# EasyEDA Pro project ProPrj_桌面数控电源New_2025-02-12.epro, board PCB3
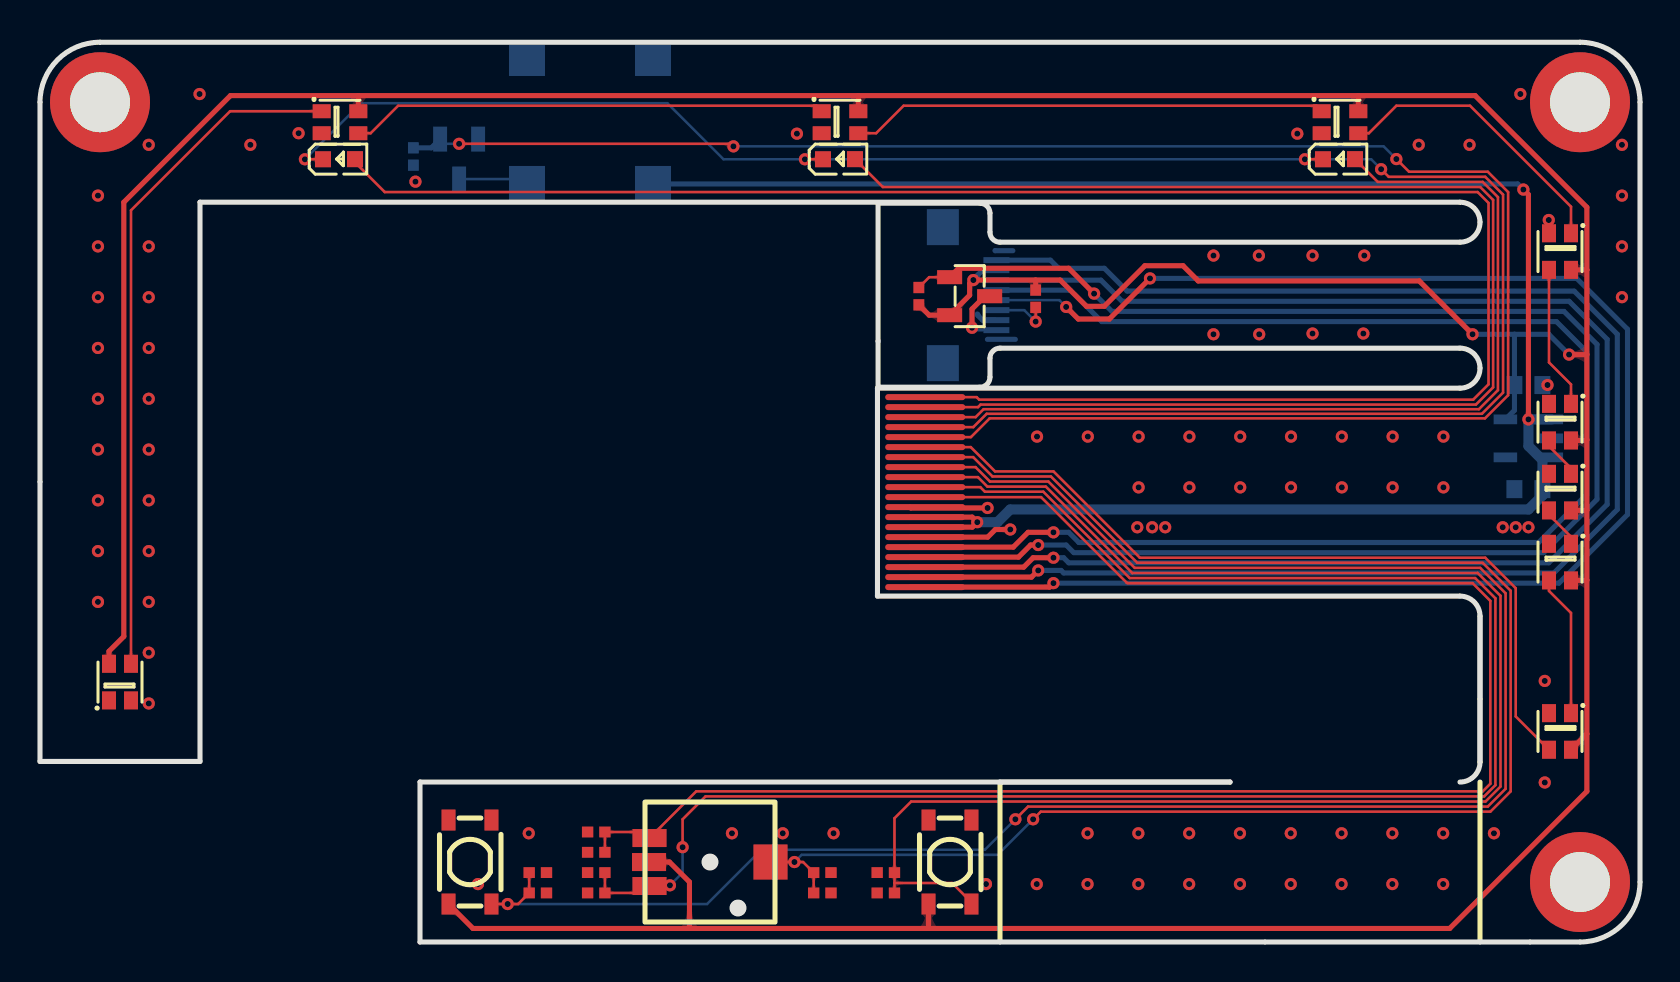
[diagram p4: board, top side]
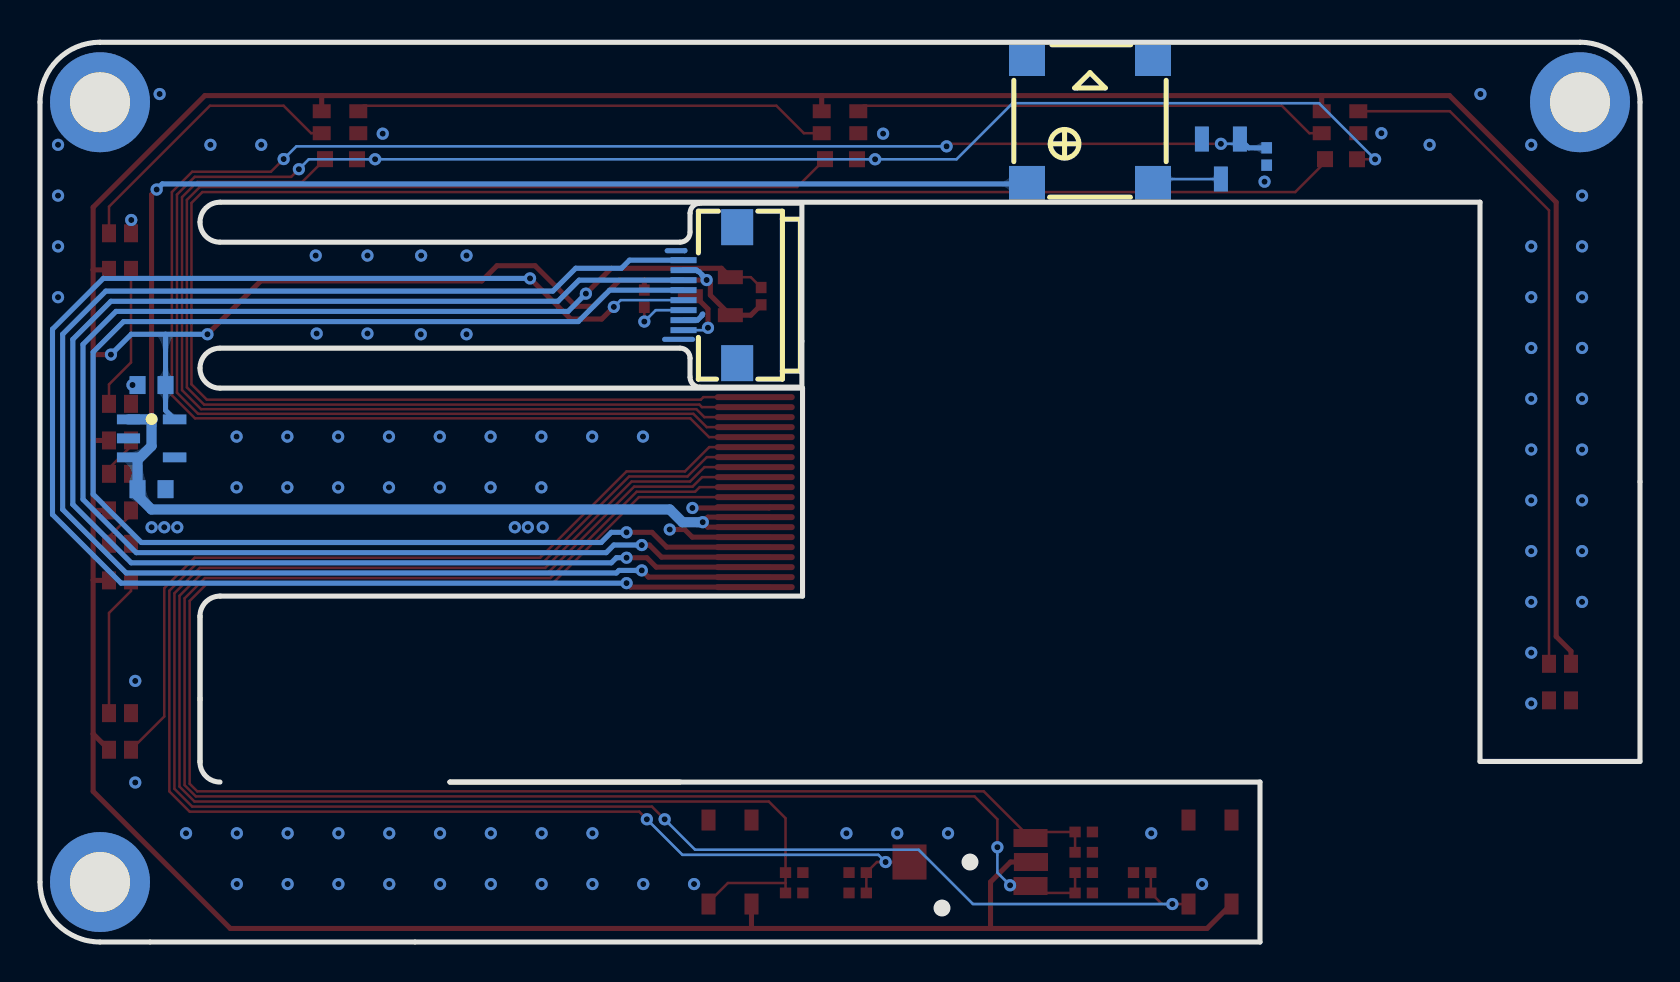
[diagram p5: board, bottom side, seen from below]

Outline 80 x 45 mm; copper layers: Top Layer, Bottom Layer. Coordinates in mm from the lower left corner of the outline.
Outline path: 48,8 59.5,8 19,8 19,0 77,0 arc(79.12,0.88) 80,3 80,42 arc(79.12,44.12) 77,45 3,45 arc(0.88,44.12) 0,42 0,9.03 8,9.03 8,37 71,37 arc(71.71,36.71) 72,36 arc(71.71,35.29) 71,35 48,35 arc(47.64,35.15) 47.5,35.5 47.5,36.45 arc(47.35,36.8) 47,36.95 41.9,36.95 41.9,27.75 47,27.75 arc(47.35,27.9) 47.5,28.25 47.5,29.2 arc(47.64,29.55) 48,29.7 71,29.7 arc(71.71,29.41) 72,28.7 arc(71.71,27.99) 71,27.7 41.87,27.7 41.87,17.3 71,17.3 arc(71.71,17.01) 72,16.3 ; 72,16.3 72,9 ; 72,16.3 72,9 ; 72,9 arc(71.71,8.29) 71,8
Stack: Top Layer 0.012mm / Dielectric1 0.025mm FR4 er 4.5 / Bottom Layer 0.012mm

## Design rules (mm)
template: JLCPCB Capability(Two Layers Board)
spacing copperThickness1oz (default): track to track 0.102, other pairs 0.152 to 0.3
spacing copperThickness2oz: track to track 0.203, other pairs 0.152 to 0.3
track width copperThickness1oz (default): min 0.127, default 0.254, max 2.54
track width copperThickness2oz: min 0.203, default 0.254, max 2.54
differential pair differentialPair (default): width min 0.127, default 0.254, max 2.54; gap min 0.152, default 0.152
via viaSize (default): diameter min 0.5, default 0.61, max 10; hole min 0.3, default 0.305, max 6.3

## Placement (name value [footprint] x y rotation side)
C28  22uF  [C0603]  74.42 22.65 0 bottom
C29  22uF  [C0603]  74.42 27.86 180 bottom
C96  100nF  [C0402]  42.29 3.47 180 top
C97  100nF  [C0402]  24.89 2.45 0 top
C98  100nF  [C0402]  39.12 2.45 0 top
C99  100nF  [C0402]  27.81 4.49 180 top
C100  100nF  [C0402]  27.81 3.47 180 top
FPC1  AFC01-S08FCA-00  [FPC-SMD_P0.50-8P_FGS-XJ-H2.0]  46.48 32.35 270 bottom
LDO1  ME6211C33M5G-N  [SOT-23-5_L3.0-W1.7-P0.95-LS2.8-BL]  74.42 25.19 270 bottom
LED1  WS2812B-2020  [LED-SMD_4P-L2.0-W2.0-TL_WS2812B-2020]  76 10.53 270 top
LED2  WS2812B-2020  [LED-SMD_4P-L2.0-W2.0-TL_WS2812B-2020]  76 19 270 top
LED3  WS2812B-2020  [LED-SMD_4P-L2.0-W2.0-TL_WS2812B-2020]  76 22.5 270 top
LED4  WS2812B-2020  [LED-SMD_4P-L2.0-W2.0-TL_WS2812B-2020]  76 26 270 top
LED5  WS2812B-2020  [LED-SMD_4P-L2.0-W2.0-TL_WS2812B-2020]  76 34.53 270 top
LED6  WS2812B-2020  [LED-SMD_4P-L2.0-W2.0-TL_WS2812B-2020]  65 41 0 top
LED7  WS2812B-2020  [LED-SMD_4P-L2.0-W2.0-TL_WS2812B-2020]  40 41 0 top
LED8  WS2812B-2020  [LED-SMD_4P-L2.0-W2.0-TL_WS2812B-2020]  15 41 0 top
LED9  -  [LED_0603]  15 39.16 0 top
LED10  -  [LED_0603]  40 39.16 0 top
LED11  -  [LED_0603]  65 39.16 0 top
LED12  WS2812B-2020  [LED-SMD_4P-L2.0-W2.0-TL_WS2812B-2020]  4 13 90 top
NOREF  -  [Pad_e144]  44.26 20.25 0 top
NOREF#2  -  [Pad_e128]  44.26 24.25 0 top
NOREF#3  -  [Pad_e132]  44.26 23.25 0 top
NOREF#4  -  [Pad_e15]  77 3 0 top
NOREF#5  -  [Pad_e142]  44.26 20.75 0 top
NOREF#6  -  [Pad_e152]  44.26 18.25 0 top
NOREF#7  -  [Pad_e134]  44.26 22.75 0 top
NOREF#8  -  [Pad_e126]  44.26 24.75 0 top
NOREF#9  -  [Pad_e154]  44.26 17.75 0 top
NOREF#10  -  [Pad_e140]  44.26 21.25 0 top
NOREF#11  -  [Pad_e116]  44.26 27.25 0 top
NOREF#12  -  [Pad_e136]  44.26 22.25 0 top
NOREF#13  -  [Pad_e13]  77 42 0 top
NOREF#14  -  [Pad_e150]  44.26 18.75 0 top
NOREF#15  -  [Pad_e148]  44.26 19.25 0 top
NOREF#16  -  [Pad_e138]  44.26 21.75 0 top
NOREF#17  -  [Pad_e124]  44.26 25.25 0 top
NOREF#18  -  [Pad_e130]  44.26 23.75 0 top
NOREF#19  -  [Pad_e120]  44.26 26.25 0 top
NOREF#20  -  [Pad_e12]  3 42 0 top
NOREF#21  -  [Pad_e118]  44.26 26.75 0 top
NOREF#22  -  [Pad_e122]  44.26 25.75 0 top
NOREF#23  -  [Pad_e146]  44.26 19.75 0 top
Q15  SI2302  [SOT-23-3_L2.9-W1.3-P1.90-LS2.4-BR]  20.96 39.16 90 bottom
Q16  SI2305  [SOT-23-3_L2.9-W1.3-P1.90-LS2.4-BR]  46.48 32.3 180 top
R75  10K  [R0402]  49.78 32.17 270 top
R81  10K  [R0402]  18.67 39.28 90 bottom
R82  10K  [R0402]  43.94 32.3 90 top
R83  1M  [R0402]  42.29 2.45 180 top
R84  1M  [R0402]  24.89 3.47 0 top
R85  1M  [R0402]  39.12 3.47 0 top
R86  1M  [R0402]  27.81 5.5 180 top
R87  1M  [R0402]  27.81 2.45 180 top
SW1  -  [EC06]  33.5 4 90 top
SW4  -  [Key_SMD_4.2x3.2x2.5]  45.5 4 90 top
SW5  -  [Key_SMD_4.2x3.2x2.5]  21.5 4 90 top
U1  2.731kHz  [BUZ-SMD_4P-L7.5-W7.5-BR]  27.5 41.06 270 bottom

## Footprints (pads in the part's own frame, mm; a bottom-side part is the same pattern mirrored in y, then rotated)
BUZ-SMD_4P-L7.5-W7.5-BR
  rect 1.8x1.8 smd: 1(3.15,-3.15) 2(3.15,3.15) 3(-3.15,3.15) 4(-3.15,-3.15)
C0402
  rect 0.566x0.54 smd: 1(-0.433,0) 2(0.433,0)
C0603
  rect 0.8x0.9 smd: 1(-0.7,0) 2(0.7,0)
EC06
  rect 0.9x1.704 smd: 1(-1.2,3.025) 2(0,3.048) 3(1.2,3.025)
  rect 1.754x1.704 smd: 4(0,-3.025)
FPC-SMD_P0.50-8P_FGS-XJ-H2.0
  rect 0.3x1.3 smd: 1(-1.75,-1.34) 2(-1.252,-1.339) 3(-0.75,-1.34) 4(-0.25,-1.34) 5(0.25,-1.34) 6(0.75,-1.34) 7(1.25,-1.34) 8(1.75,-1.34)
  rect 1.8x1.6 smd: 9(3.4,1.34) 10(-3.4,1.34)
Key_SMD_4.2x3.2x2.5
  rect 1.049x0.701 smd: 1(-2.1,1.075) 2(2.1,1.075) 3(-2.1,-1.075) 4(2.1,-1.075)
LED-SMD_4P-L2.0-W2.0-TL_WS2812B-2020
  rect 0.9x0.7 smd: 1(-0.915,0.55) 2(-0.915,-0.55) 3(0.915,-0.55) 4(0.915,0.55)
LED_0603
  rect 0.8x0.8 smd: 1(-0.851,-0.01) 2(0.75,-0.005)
Pad_e12
  round 5 hole 3: 1(0,0)
Pad_e13
  round 5 hole 3: 1(0,0)
Pad_e15
  round 5 hole 3: 1(0,0)
Pad_e116
  oval 4x0.3 smd: 1(0,0)
Pad_e118
  oval 4x0.3 smd: 1(0,0)
Pad_e120
  oval 4x0.3 smd: 1(0,0)
Pad_e122
  oval 4x0.3 smd: 1(0,0)
Pad_e124
  oval 4x0.3 smd: 1(0,0)
Pad_e126
  oval 4x0.3 smd: 1(0,0)
Pad_e128
  oval 4x0.3 smd: 1(0,0)
Pad_e130
  oval 4x0.3 smd: 1(0,0)
Pad_e132
  oval 4x0.3 smd: 1(0,0)
Pad_e134
  oval 4x0.3 smd: 1(0,0)
Pad_e136
  oval 4x0.3 smd: 1(0,0)
Pad_e138
  oval 4x0.3 smd: 1(0,0)
Pad_e140
  oval 4x0.3 smd: 1(0,0)
Pad_e142
  oval 4x0.3 smd: 1(0,0)
Pad_e144
  oval 4x0.3 smd: 1(0,0)
Pad_e146
  oval 4x0.3 smd: 1(0,0)
Pad_e148
  oval 4x0.3 smd: 1(0,0)
Pad_e150
  oval 4x0.3 smd: 1(0,0)
Pad_e152
  oval 4x0.3 smd: 1(0,0)
Pad_e154
  oval 4x0.3 smd: 1(0,0)
R0402
  rect 0.566x0.54 smd: 1(-0.433,0) 2(0.433,0)
SOT-23-3_L2.9-W1.3-P1.90-LS2.4-BR
  rect 1.25x0.7 smd: 1(1,-0.95) 2(1,0.95) 3(-1,0)
SOT-23-5_L3.0-W1.7-P0.95-LS2.8-BL
  rect 0.49x1.157 smd: 1(-0.95,-1.153) 2(0,-1.153) 3(0.95,-1.153)
  rect 0.49x1.175 smd: 4(0.95,1.153) 5(-0.95,1.153)

## Nets
+3.3V: C29.2 FPC1.2 LDO1.5 LED1.4 LED2.4 LED3.4 LED4.4 LED5.4 LED6.4 LED7.4 LED8.4 LED12.4 Q16.2 R75.1 R82.1 SW1.2 SW4.1 SW5.1
+5V: C28.2 LDO1.1 LDO1.3 NOREF#5.1 NOREF#10.1 U1.1
DGND: LED9.1 LED10.1 LED11.1 NOREF#22.1
GND: C28.1 C29.1 C96.2 C97.2 C98.2 C99.2 C100.2 FPC1.7 FPC1.9 FPC1.10 LDO1.2 LED1.2 LED2.2 LED3.2 LED4.2 LED5.2 LED6.2 LED7.2 LED8.2 LED12.2 NOREF.1 NOREF#4.1 NOREF#13.1 NOREF#16.1 NOREF#20.1 Q15.2 R81.1 R83.2 R84.2 R85.2 R86.2 R87.2 U1.3 U1.4
BEEP: NOREF#17.1 Q15.1 R81.2
BTN-1: C96.1 NOREF#3.1 R83.1 SW4.3
BTN-2: C97.1 NOREF#18.1 R84.1 SW5.3
BTN-ENC: C98.1 NOREF#2.1 R85.1 SW1.4
ENCODER-CH1: C99.1 NOREF#12.1 R86.1 SW1.3
ENCODER-CH2: C100.1 NOREF#7.1 R87.1 SW1.1
LCD-BG-LIGHT-CTRL: NOREF#15.1 Q16.1 R82.2
LCD-CS: FPC1.1 NOREF#6.1
LCD-DC: FPC1.5 NOREF#9.1
LCD-SCL: FPC1.3 NOREF#14.1
LCD-SDA: FPC1.4 NOREF#23.1
LED-1: LED9.2 NOREF#11.1
LED-2: LED10.2 NOREF#21.1
LED-3: LED11.2 NOREF#19.1
SERIAL-LED: LED1.3 NOREF#8.1
$1N713: LED1.1 LED2.3
$1N719: LED2.1 LED3.3
$1N726: LED3.1 LED4.3
$1N733: LED4.1 LED5.3
$1N740: LED5.1 LED6.3
$1N747: LED6.1 LED7.3
$1N754: LED7.1 LED8.3
$1N1255: LED8.1 LED12.3
$1N1431: Q15.3 U1.2
$1N1764: FPC1.8 Q16.3
$1N1782: FPC1.6 R75.2

Pads without a net: LDO1 4; LED12 1; SW4 2 4; SW5 2 4

## Via types
v1: diameter 0.61, hole 0.305, Top Layer to Bottom Layer, 122 vias

## Routing (per net, layer and track width the routed paths; a pad name or vN(x,y) marks a point on that pad's centre or on a via; arc(x,y) is an arc through that point)
+3.3V: length 247.4
  Top Layer w0.254: LED2.4 77.33,18.08 77.34,18.1 ; R75.1 49.78,33.11 ; 49.78,33.11 51.01,33.11 52.32,31.79 53.21,31.79 55.25,33.82 57.15,33.82 57.91,33.06 68.96,33.06 v1(71.63,30.39) ; 49.78,33.11 v1(46.67,33.11) 46.65,33.11 46.48,32.94 46.48,32.35 Q16.2 44.46,31.35 43.94,31.87 ; 65.91,42.33 40.91,42.33 ; 65.91,42.33 65.91,42.32 LED6.4 ; 65.91,42.33 71.75,42.33 77.34,36.75 77.34,33.62 ; 40.91,42.33 40.91,42.33 LED7.4 ; 40.91,42.33 15.91,42.33 ; SW1.2 31.47,4 32.47,3 32.47,0.68 ; LED4.4 77.32,25.08 77.34,25.11 ; 77.34,10.41 77.34,18.1 ; 77.34,10.41 77.34,7.53 70.49,0.68 44.43,0.68 ; 77.34,10.41 LED1.4 ; 77.34,18.1 77.34,21.6 ; 77.34,25.11 77.34,29.39 ; 77.34,25.11 77.34,21.6 ; 77.34,29.39 77.34,33.62 ; 77.34,29.39 77.33,29.38 v1(76.45,29.38) ; 32.47,0.68 44.43,0.68 ; 32.47,0.68 21.65,0.68 SW5.1 ; 44.43,0.68 44.43,0.68 SW4.1 ; 77.34,33.62 77.34,33.62 LED5.4 ; LED3.4 77.33,21.58 77.34,21.6 ; 15.91,42.33 15.92,42.33 LED8.4 ; 15.91,42.33 9.53,42.33 4.19,37 4.19,15.28 3.45,14.54 LED12.4
  Bottom Layer w0.254: v1(46.67,33.11) 46.89,33.33 46.89,33.37 47.06,33.53 47.09,33.53 47.16,33.6 FPC1.2 ; 73.72,30.39 v1(71.63,30.39) ; 73.72,30.39 75.44,30.39 v1(76.45,29.38) ; 73.72,30.39 C29.2 73.72,26.59 LDO1.5
+5V: length 96.2
  Top Layer w0.254: v1(74.17,37.63) 74.42,37.38 v1(74.42,26.14) ; 43.5,20.75 46.62,20.75 v1(46.86,21) 46.61,21.25 43.5,21.25
  Bottom Layer w0.254: U1.1 73.89,37.91 v1(74.17,37.63)
  Bottom Layer w0.508: v1(46.86,21) 47.87,21 48.51,21.63 74.42,21.63 75.12,22.33 C28.2 75.12,24.11 74.42,24.81 v1(74.42,26.14) LDO1.1
DGND: length 105.9
  Top Layer w0.127: LED11.1 v1(63.25,39.15) ; v1(67.06,38.65) 67.44,38.27 72.26,38.27 73.15,37.38 73.15,27.47 72.1,26.42 47.33,26.42 46.66,25.75 43.5,25.75 ; v1(13.25,39.15) 14.15,39.15 ; v1(38.25,39.15) 39.15,39.15
  Bottom Layer w0.127: v1(13.25,39.15) 16.05,41.95 31.37,41.95 34.17,39.15 v1(38.25,39.15) 66.56,39.15 v1(67.06,38.65)
GND: length 12.5
  Top Layer w0.254: v1(47.38,21.71) 43.54,21.71 43.5,21.75 ; v1(48.51,20.63) 47.77,20.63 47.39,20.25 43.5,20.25
  Bottom Layer w0.254: 48.64,34.57 47.76,34.57 47.75,34.59 ; FPC1.7 47.13,31.1 46.89,31.33 46.89,31.38 46.86,31.41 ; 47.37,30.14 48.77,30.14
  vias: v1(2.9,37.33) v1(2.9,34.79) v1(2.9,32.25) v1(2.9,29.71) v1(2.9,27.17) v1(2.9,24.63) v1(2.9,22.09) v1(2.9,19.55) v1(2.9,17.01) v1(5.44,39.87) v1(5.44,34.79) v1(5.44,32.25) v1(5.44,29.71) v1(5.44,27.17) v1(5.44,24.63) v1(5.44,22.09) v1(5.44,19.55) v1(5.44,17.01) v1(5.44,14.47) v1(5.44,11.93) v1(7.98,42.41) v1(10.52,39.87) v1(12.93,40.45) v1(18.77,38.03) v1(21.9,2.9) v1(24.44,5.44) v1(34.6,5.44) v1(37.14,5.44) v1(37.85,40.43) v1(39.68,5.44) v1(47.3,2.9) v1(49.84,2.9) v1(49.85,25.28) v1(52.39,25.28) v1(52.38,5.44) v1(52.38,2.9) v1(54.93,25.28) v1(54.93,22.74) v1(54.86,20.74) v1(54.92,5.44) v1(54.92,2.9) v1(55.61,20.74) v1(56.26,20.74) v1(57.47,25.28) v1(57.47,22.74) v1(57.46,5.44) v1(57.46,2.9) v1(58.67,34.33) v1(58.67,30.39) v1(60.01,25.28) v1(60.01,22.74) v1(60,5.44) v1(60,2.9) v1(60.94,34.33) v1(60.96,30.39) v1(62.54,5.44) v1(62.54,2.9) v1(62.55,25.28) v1(62.55,22.74) v1(62.87,40.43) v1(63.63,34.33) v1(63.63,30.43) v1(65.09,25.28) v1(65.09,22.74) v1(65.08,5.44) v1(65.08,2.9) v1(66.21,34.33) v1(66.17,30.43) v1(67.63,25.28) v1(67.63,22.74) v1(67.62,5.44) v1(67.62,2.9) v1(68.94,39.87) v1(70.17,25.28) v1(70.17,22.74) v1(70.16,5.44) v1(70.16,2.9) v1(71.48,39.87) v1(72.7,5.44) v1(73.14,20.74) v1(73.79,20.74) v1(74.02,42.41) v1(74.42,20.74) v1(75.24,13.06) v1(75.24,7.98) v1(75.44,36.11) v1(75.38,27.86) v1(79.1,39.87) v1(79.1,37.33) v1(79.1,34.79) v1(79.1,32.25)
BEEP: length 97.1
  Top Layer w0.127: v1(67.82,39.16) 68.45,38.52 72.39,38.52 73.41,37.51 73.41,27.35 72.25,26.19 47.48,26.19 46.54,25.25 43.5,25.25 ; v1(34.67,39.79) 34.54,39.92 v1(20.96,39.92)
  Bottom Layer w0.127: v1(20.96,39.92) 20.01,39.92 19.81,39.72 ; v1(67.82,39.16) 67.18,39.79 v1(34.67,39.79)
  Bottom Layer w0.254: 20,40.16 19.56,39.72 R81.2
BTN-1: length 80.5
  Top Layer w0.127: 42.72,2.95 C96.1 42.72,6.19 43.56,7.03 72.28,7.03 73.03,7.78 73.03,17.31 71.88,18.46 54.61,18.46 50.29,22.78 47.37,22.78 46.9,23.25 43.5,23.25 ; 42.72,2.95 R83.1 ; 42.72,2.95 45.6,2.95 46.57,1.98 SW4.3
BTN-2: length 97.6
  Top Layer w0.127: SW5.3 v1(23.38,1.9) 23.9,1.9 C97.1 R84.1 ; 43.5,23.75 46.78,23.75 47.5,23.03 50.42,23.03 54.74,18.71 72.01,18.71 73.28,17.44 73.28,7.66 72.39,6.77 49.4,6.77 v1(48.77,6.14)
  Bottom Layer w0.127: v1(23.38,1.9) 33.35,1.9 36.07,4.61 47.24,4.61 v1(48.77,6.14)
BTN-ENC: length 83.5
  Top Layer w0.127: v1(49.66,6.14) 50.04,6.52 72.52,6.52 73.53,7.53 73.53,17.57 72.14,18.97 54.86,18.97 50.55,23.28 47.62,23.28 46.66,24.25 43.5,24.25 ; SW1.4 v1(37.72,4) 38.15,4 R85.1 C98.1
  Bottom Layer w0.127: v1(37.72,4) 38.08,4.36 47.88,4.36 v1(49.66,6.14)
ENCODER-CH1: length 86.8
  Top Layer w0.127: 43.5,22.25 50.06,22.25 54.36,17.95 71.63,17.95 72.52,17.06 72.52,7.92 72.14,7.53 32.81,7.53 SW1.3 30.17,5.5 R86.1 C99.1
ENCODER-CH2: length 90.3
  Top Layer w0.127: SW1.1 30.13,2.45 R87.1 C100.1 ; v1(32.13,4.74) 32.13,6.14 33.27,7.28 72.21,7.28 72.77,7.85 72.77,17.19 71.75,18.2 54.48,18.2 50.16,22.52 47.24,22.52 47.01,22.75 43.5,22.75
  Top Layer w0.254: v1(31.5,2.84) 31.46,2.8 SW1.1
  Bottom Layer w0.127: v1(32.13,4.74) 32.13,3.47 v1(31.5,2.84)
LCD-BG-LIGHT-CTRL: length 79.5
  Top Layer w0.127: R82.2 44.46,33.25 Q16.1
  Top Layer w0.254: v1(52.71,32.43) 51.44,33.7 45.93,33.7 Q16.1 ; v1(49.91,19.85) 49.53,19.85 48.93,19.25 43.5,19.25
  Bottom Layer w0.254: v1(49.91,19.85) 51.31,19.85 51.69,19.47 75.18,19.47 77.85,22.14 77.85,29.89 76.2,31.54 53.59,31.54 v1(52.71,32.43)
LCD-CS: length 78.2
  Top Layer w0.254: 43.5,18.25 49.58,18.25 v1(49.91,18.58)
  Bottom Layer w0.254: FPC1.1 50.52,34.1 50.93,33.7 53.21,33.7 54.36,32.55 76.71,32.55 78.87,30.39 78.87,21.63 75.69,18.46 51.18,18.46 51.05,18.58 v1(49.91,18.58)
LCD-DC: length 80.5
  Top Layer w0.254: v1(51.31,31.76) 51.91,31.16 53.47,31.16 v1(55.5,33.19) ; 43.5,17.75 50.47,17.75 v1(50.67,17.95)
  Bottom Layer w0.127: FPC1.5 50.97,32.1 v1(51.31,31.76)
  Bottom Layer w0.254: v1(55.5,33.19) 76.84,33.19 79.38,30.65 79.38,21.38 75.95,17.95 v1(50.67,17.95)
LCD-SCL: length 76.4
  Top Layer w0.254: 43.5,18.75 49.19,18.75 49.66,19.22 v1(50.67,19.22)
  Bottom Layer w0.254: FPC1.3 53.05,33.1 54.1,32.05 76.45,32.05 78.36,30.14 78.36,21.89 75.44,18.97 51.44,18.97 51.18,19.22 v1(50.67,19.22)
LCD-SDA: length 73.3
  Top Layer w0.254: 43.5,19.75 48.66,19.75 49.4,20.49 v1(50.67,20.49)
  Bottom Layer w0.254: FPC1.4 51.52,32.6 53.09,31.03 75.82,31.03 77.34,29.51 77.34,22.39 74.93,19.98 51.94,19.98 51.44,20.49 v1(50.67,20.49)
LED-1: length 95.9
  Top Layer w0.127: 15.75,39 17.24,37.51 71.88,37.51 72.43,36.96 72.43,27.89 71.66,27.12 46.96,27.12 46.83,27.25 43.5,27.25
LED-2: length 71.7
  Top Layer w0.127: 43.5,26.75 46.9,26.75 47.03,26.88 71.79,26.88 72.66,27.74 72.66,37.11 72.01,37.76 42.14,37.76 LED10.2
LED-3: length 47.5
  Top Layer w0.127: 43.5,26.25 46.78,26.25 47.18,26.65 71.94,26.65 72.9,27.6 72.9,37.25 72.14,38.02 66.89,38.02 LED11.2
SERIAL-LED: length 42
  Top Layer w0.127: LED1.3 73.79,11.28 73.79,17.69 72.26,19.22 54.99,19.22 50.67,23.54 47.75,23.54 46.54,24.75 43.5,24.75
$1N713: length 7.1
  Top Layer w0.127: LED1.1 76.55,16.46 75.45,17.56 LED2.3
$1N719: length 2.1
  Top Layer w0.127: LED2.1 76.55,20.27 75.45,21.37 LED3.3
$1N726: length 2.1
  Top Layer w0.127: LED3.1 76.55,23.69 75.45,24.8 LED4.3
$1N733: length 7.2
  Top Layer w0.127: LED4.1 76.55,27.89 75.45,28.99 LED5.3
$1N740: length 14.6
  Top Layer w0.127: LED6.3 66.44,40.45 67.82,41.83 71.5,41.83 76.55,36.78 LED5.1
$1N747: length 23.9
  Top Layer w0.127: LED7.3 41.81,40.45 43.18,41.83 63.81,41.83 LED6.1
$1N754: length 23.9
  Top Layer w0.127: LED7.1 38.81,41.83 17.91,41.83 16.53,40.45 LED8.3
$1N1255: length 34.3
  Top Layer w0.127: LED12.3 4.55,36.6 9.5,41.55 LED8.1
$1N1431: length 4.2
  Bottom Layer w0.127: Q15.3 25.18,38.16
$1N1764: length 3.4
  Top Layer w0.254: v1(46.6,30.72) 46.6,31.66 47.24,32.3 Q16.3
  Bottom Layer w0.127: v1(46.6,30.72) 46.72,30.6 FPC1.8
$1N1782: length 2.9
  Top Layer w0.127: v1(49.78,31.03) R75.2
  Bottom Layer w0.127: v1(49.78,31.03) 49.21,31.6 FPC1.6

## Copper pours and planes (outline as drawn; the poured copper is in the pictures)
GND on Top Layer: -4.57,49.57 83.95,49.57 83.95,-2.88 -4.57,-2.88
GND on Bottom Layer: -2.54,48.23 85.98,48.23 85.98,-4.22 -2.54,-4.22

Small or netless copper shapes (teardrops, artwork), in the pictures only: 104 on Top Layer, 39 on Bottom Layer
